# EAGLE design BRD100612 (EAGLE 5.04)
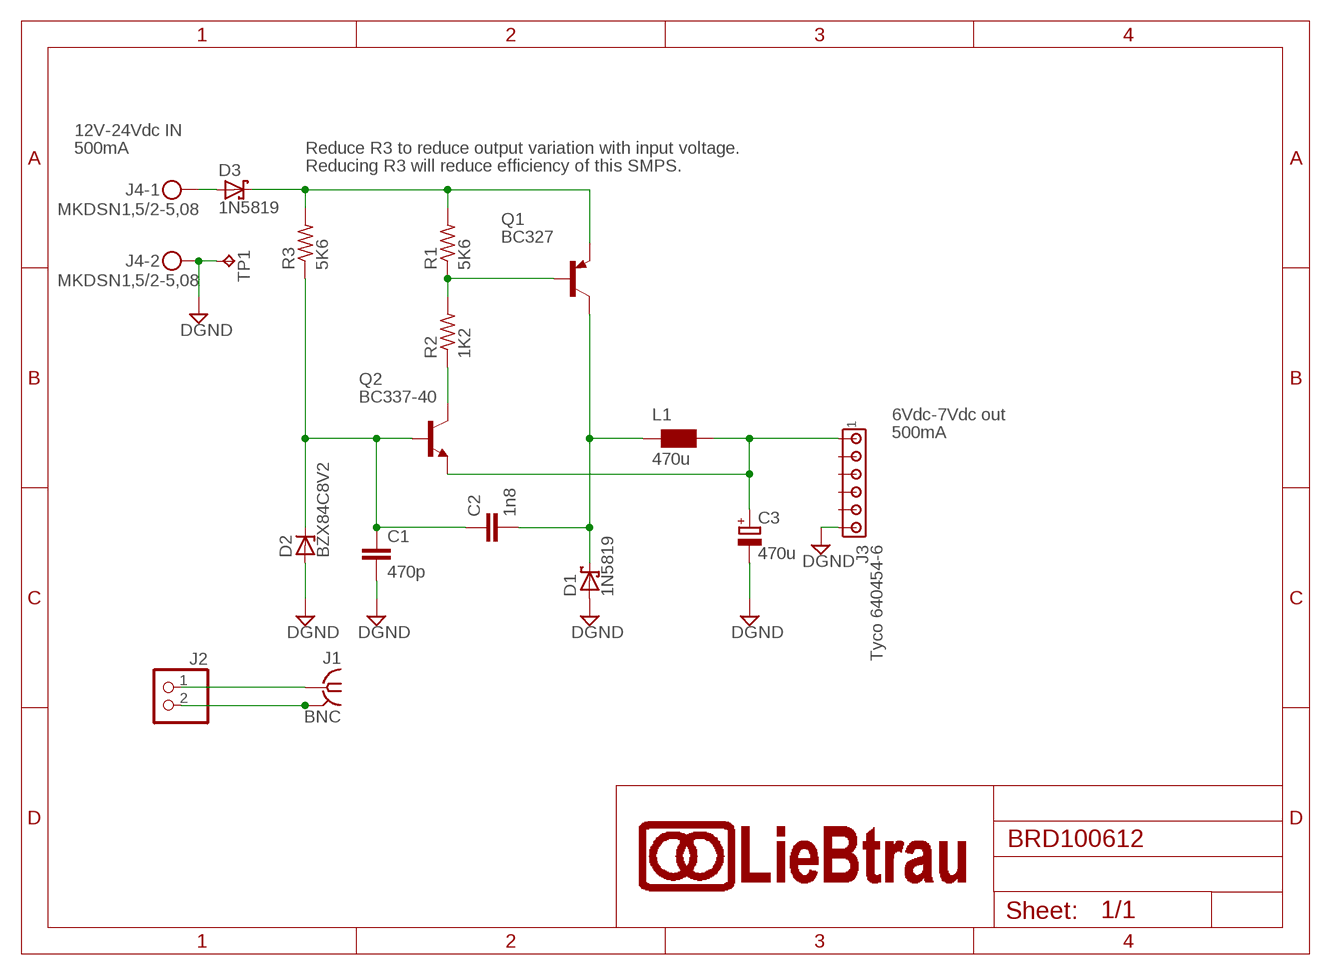
[diagram p0: schematic, sheet 1]

## Parts
C1  470p  C-EU025-030X050  [C025-030X050]
C2  1n8  C-EU050-055X075  [C050-055X075]
C3  470u  CPOL-EUE30-12AXIAL  [E30-12]
D1  1N5819  [DO41-10]
D2  BZX84C8V2  BZX55  [DO35Z10]
D3  1N5819  [DO41-10]
FRAME1  A5L-LOC  [A5L-LOC]
J1  BNC  [BNC]
J2  PINHD-1X2  [1X02]
J3  Tyco 640454-6  MTA06-100  [10X06MTA]
J4  MKDSN1,5/2-5,08  [MKDSN1,5/2-5,08]
L1  470u  WE-PD_L/XL/XXL  [WE-PD_L/XL/XXL]
Q1  BC327  [TO92]
Q2  BC337-40  [TO92]
R1  5K6  R-US_0207/10  [0207/10]
R2  1K2  R-US_0207/10  [0207/10]
R3  5K6  R-US_0207/10  [0207/10]
TP1  TPPAD1-13Y  [P1-13Y]

## Nets
DGND: C1.2 C3.- D1.A D2.A J3.1 J4.2 TP1.1(TP)
N$1: J1.SIG J2.1
N$2: J1.GND@1(GND) J1.GND@2(GND) J1.GND@3(GND) J1.GND@4(GND) J2.2
N$3: C3.+ J3.6 L1.1 Q2.1(E)
N$4: C2.2 D1.C L1.2 Q1.3(C)
N$5: D3.C Q1.1(E) R1.2 R3.2
N$6: Q1.2(B) R1.1 R2.2
N$7: Q2.3(C) R2.1
N$8: C1.1 C2.1 D2.C Q2.2(B) R3.1
N$9: D3.A J4.1
Unconnected: J3.2 J3.3 J3.4 J3.5

## Notes on the sheet
- 12V-24Vdc IN
- 500mA | Reduce R3 to reduce output variation with input voltage.
- Reducing R3 will reduce efficiency of this SMPS.
- 6Vdc-7Vdc out
- 500mA

## Library data of the parts
C1 C2 = rcl:C-EU: CAPACITOR, European symbol
C3 = rcl:CPOL-EU: POLARIZED CAPACITOR, European symbol
D1 D3 = Traficon:1N5819
D2 = diode:BZX55: Z DIODE
FRAME1 = liebtrau:A5L-LOC: A5L LOC
J1 = Traficon:BNC: BNC Amphenol connector (straight)
J2 = pinhead:PINHD-1X2: PIN HEADER
J3 = con-amp:MTA06-100: AMP connector
J4 = con-phoenix-508:MKDSN1,5/2-5,08: MKDSN 1,5/ 2-5,08 Printklemme Nennstrom: 13,5 A Nennspannung: 250 V Rastermaß: 5,08 mm Polzahl: 2 Anschlussart: Schraubanschluss Montage: Löten Anschlussrichtung Leiter/Platine: 0 ° Artikelnummer: 1729128 Source: http://eshop.phoenixcontact.com .. 1729128.pdf
L1 = wuerth-elektronik:WE-PD: SMD-Shielded Power Inductors WE-PD Is recommended for the application with switching regulators from National Semiconductor, Linear Technology, Texas Instruments and Fairchild Semiconductor - Magnetically shielded version which results in a low leakage field - High storage capacity - Low self-losses -- Switching regulators with low operating voltages (computer, laptop, mobile phones, pagers) -- Integrated DC/DC-converter
Q1 = transistor-pnp:BC327: PNP Transistor
Q2 = transistor-npn:BC337*: NPN Transistor
R1-R3 = rcl:R-US_: RESISTOR, American symbol
TP1 = testpad:TP: Test pad

## Board
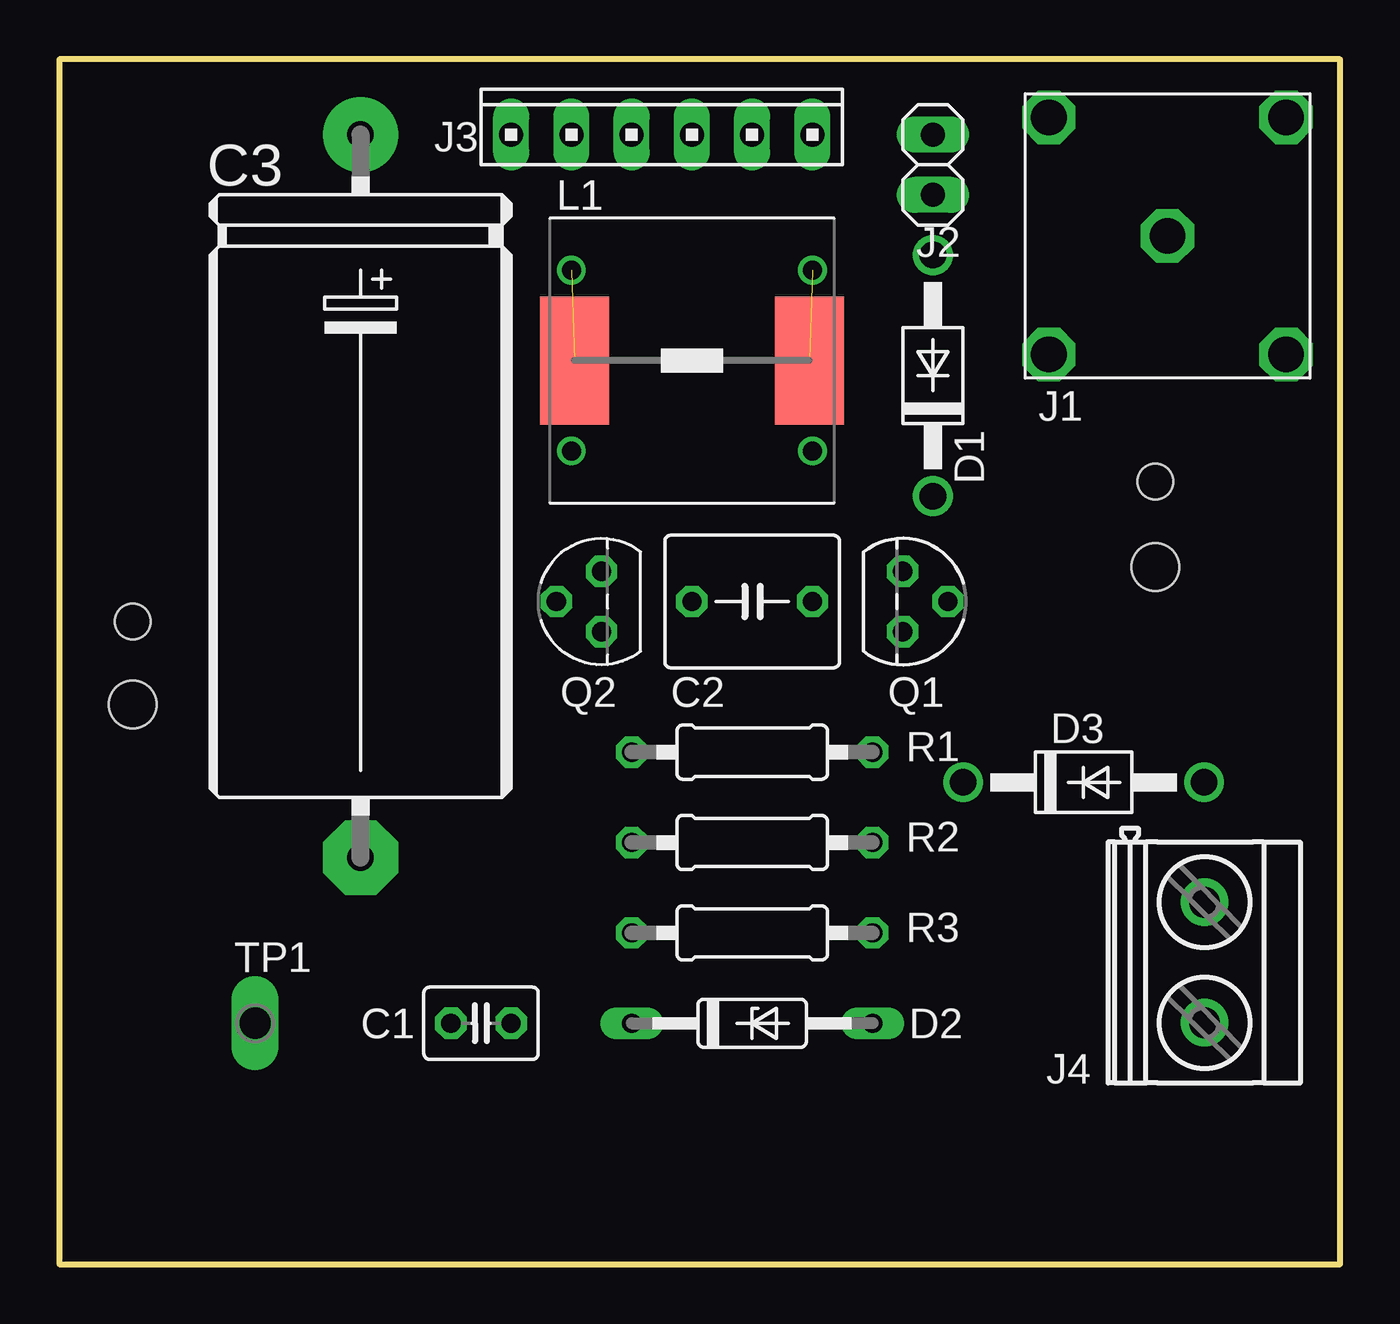
[diagram p1: board, top side]
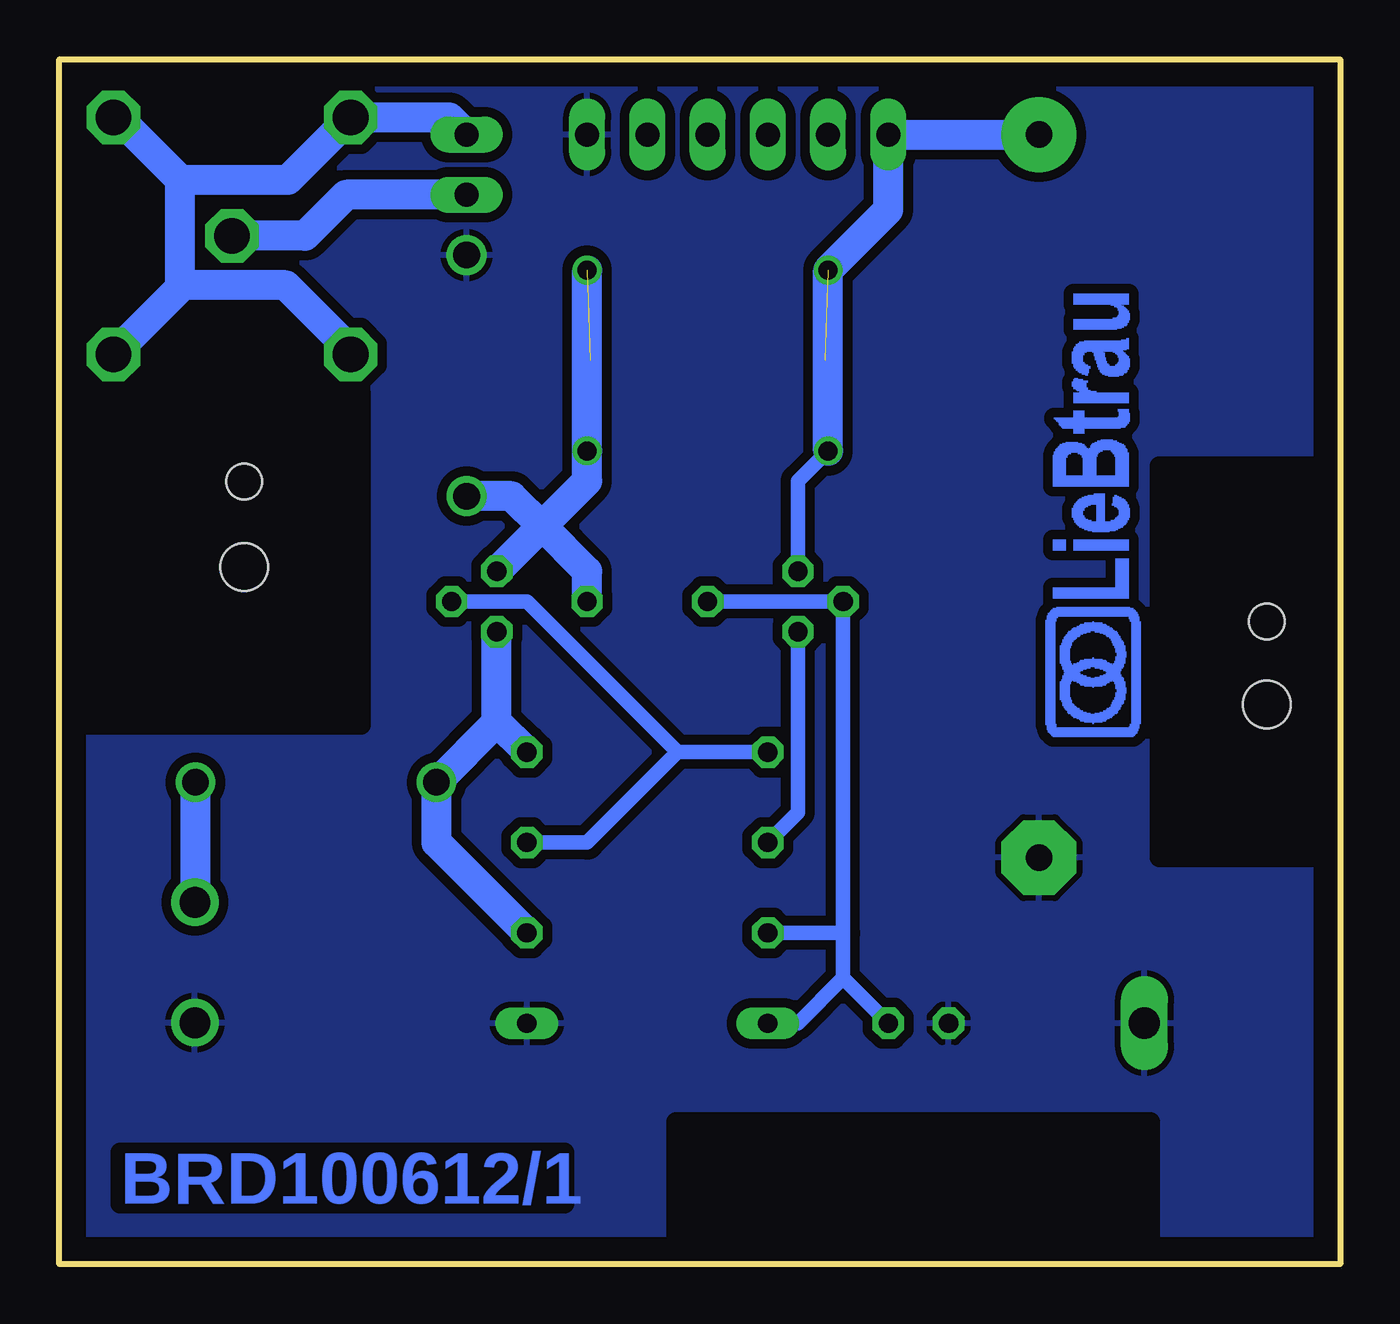
[diagram p2: board, bottom side, seen from below]

Size 54 x 50.8 mm. Coordinates in mm from the lower left corner, seen from the top.
Outline: 0,0 54,0 54,50.8 0,50.8 0,0
Copper layers (1*16): Top 0.035mm / dielectric 1.5mm / Bottom 0.035mm
Design rules "default": minimum track width 10mil, minimum drill 24mil, track to track 8mil, track to pad 8mil, pad to pad 8mil, via to via 8mil, smd to smd 8mil, copper to edge 40mil, drill to drill 8mil, minimum pad ring 10mil, minimum via ring 8mil, stop-mask expansion 4mil, vias tented up to drill 0mil, thermal gap 10mil
Holes 2 mm at 46.2,29.4 3.1,23.6
Holes 1.5 mm at 46.2,33 3.1,27.1
tKeepout: area 0,17.4 to 8,50.4; area 41.3,22.7 to 55.3,36.7; area 8,0 to 28,6
tRestrict: area 0,17.4 to 8,50.4
bRestrict: area 41.3,22.7 to 55.3,36.7; area 8,0 to 28,6; area 0,17.1 to 7.6,33.7

### Footprints (pad centres in the part's own frame; a part is rotated, then mirrored left to right if it is on the bottom)
C025-030X050 = drill 0.813 octagon: 1 -1.27,0; 2 1.27,0
C050-055X075 = drill 0.813 octagon: 1 -2.54,0; 2 2.54,0
E30-12 = drill 1.118 pad 3.15 round: + -15.24,0 | drill 1.118 pad 3.15 octagon: - 15.24,0
DO41-10 = drill 1.118 round: A 5.08,0; C -5.08,0
DO35Z10 = drill 0.813 long: A 5.08,0; C -5.08,0
BNC = drill 1.5 octagon: GND@1 -5.27,4.54; GND@2 4.73,4.54; GND@3 4.73,-5.46; GND@4 -5.27,-5.46; SIG -0.27,-0.46
1X02 = drill 1.016 long: 1 -1.27,0; 2 1.27,0
10X06MTA = drill 1.016 long: 1 6.35,0; 2 3.81,0; 3 1.27,0; 4 -1.27,0; 5 -3.81,0; 6 -6.35,0
MKDSN1,5/2-5,08 = drill 1.3 pad 2 round: 1 -2.561,0.025; 2 2.519,0.025
WE-PD_L/XL/XXL = smd 2.9 x 5.4: 1 -4.95,0; 2 4.95,0
TO92 = drill 0.813 octagon: 1 1.27,0; 2 0,1.905; 3 -1.27,0
0207/10 = drill 0.813 octagon: 1 -5.08,0; 2 5.08,0
P1-13Y = drill 1.321 pad 1.905 long: 1 0,0

### Placement (x,y rotation side)
C1  17.78,10.16 180 top
C2  29.21,27.94 0 top
C3  12.7,32.38 270 top
D1  36.83,37.47 90 top
D2  29.21,10.16 0 top
D3  43.18,20.32 0 top
FRAME1  -64.58,-57.19 0 top  (outside the outline)
J1  46.99,43.81 0 top
J2  36.83,46.35 90 top
J3  25.4,47.62 0 top
J4  48.26,12.7 270 top
L1  26.67,38.1 0 top
Q1  35.56,27.94 270 top
Q2  22.86,27.94 90 top
R1  29.21,21.59 0 top
R2  29.21,17.78 0 top
R3  29.21,13.97 0 top
TP1  8.26,10.16 0 top
U$1  [LIEBTRAU_PCB]  7.62,21.59 90 bottom

### Tracks (layer width: path | path; a pad name or v marks a point on that pad's centre or on a via)
DGND
  pour Bottom (isolate 0.406): -2.54,54.61 -2.54,-3.81 63.5,-3.81 63.5,53.34 60.96,53.34
N$1
  Bottom 1.27: J2.1 41.91,45.09 43.64,43.35 J1.SIG
N$2
  Bottom 1.27: J2.2 37.56,48.35 J1.GND@1 44.35,45.72 48.9,45.72 | J1.GND@4 41.72,38.55 44.45,41.27 48.9,41.27 | J1.GND@2 51.53,48.35 48.9,45.72 | 48.9,41.27 48.9,45.72 | J1.GND@3 48.9,41.18 48.9,41.27
N$3  (via drill 0.8)  (1 unrouted)
  Bottom 0.61: Q2.1 22.86,33.02 v21.59,34.29
  Bottom 1.27: v21.59,34.29 v21.59,41.91 19.05,44.45 J3.6 C3.+
N$4  (via drill 0.8)  (1 unrouted)
  Bottom 1.27: C2.2 31.75,29.21 33.66,31.11 | 33.66,31.11 Q1.3 | 33.66,31.11 31.75,33.02 v31.75,34.29 v31.75,41.91 | D1.C 34.92,32.38 33.66,31.11
N$5
  Bottom 1.27: 35.56,22.86 Q1.1 | 35.56,22.86 R1.2 | 35.56,22.86 D3.C 38.1,17.78 R3.2
N$6
  Bottom 0.61: R1.1 27.94,21.59 | 27.94,21.59 31.75,17.78 R2.2 | Q1.2 34.29,27.94 27.94,21.59
N$7
  Bottom 0.61: Q2.3 22.86,19.05 R2.1
N$8
  Bottom 0.61: C2.1 Q2.2 20.95,13.97 | 20.95,12.06 20.95,13.97 | C1.1 20.95,12.06 | D2.C 22.86,10.16 20.95,12.06 | 20.95,13.97 R3.1
N$9
  Bottom 1.27: J4.1 48.26,15.29 D3.A

### Text on the board
Bottom: BRD100612/1